# EAGLE design Nutrient Management Control v2.2 (EAGLE 9.6.2)
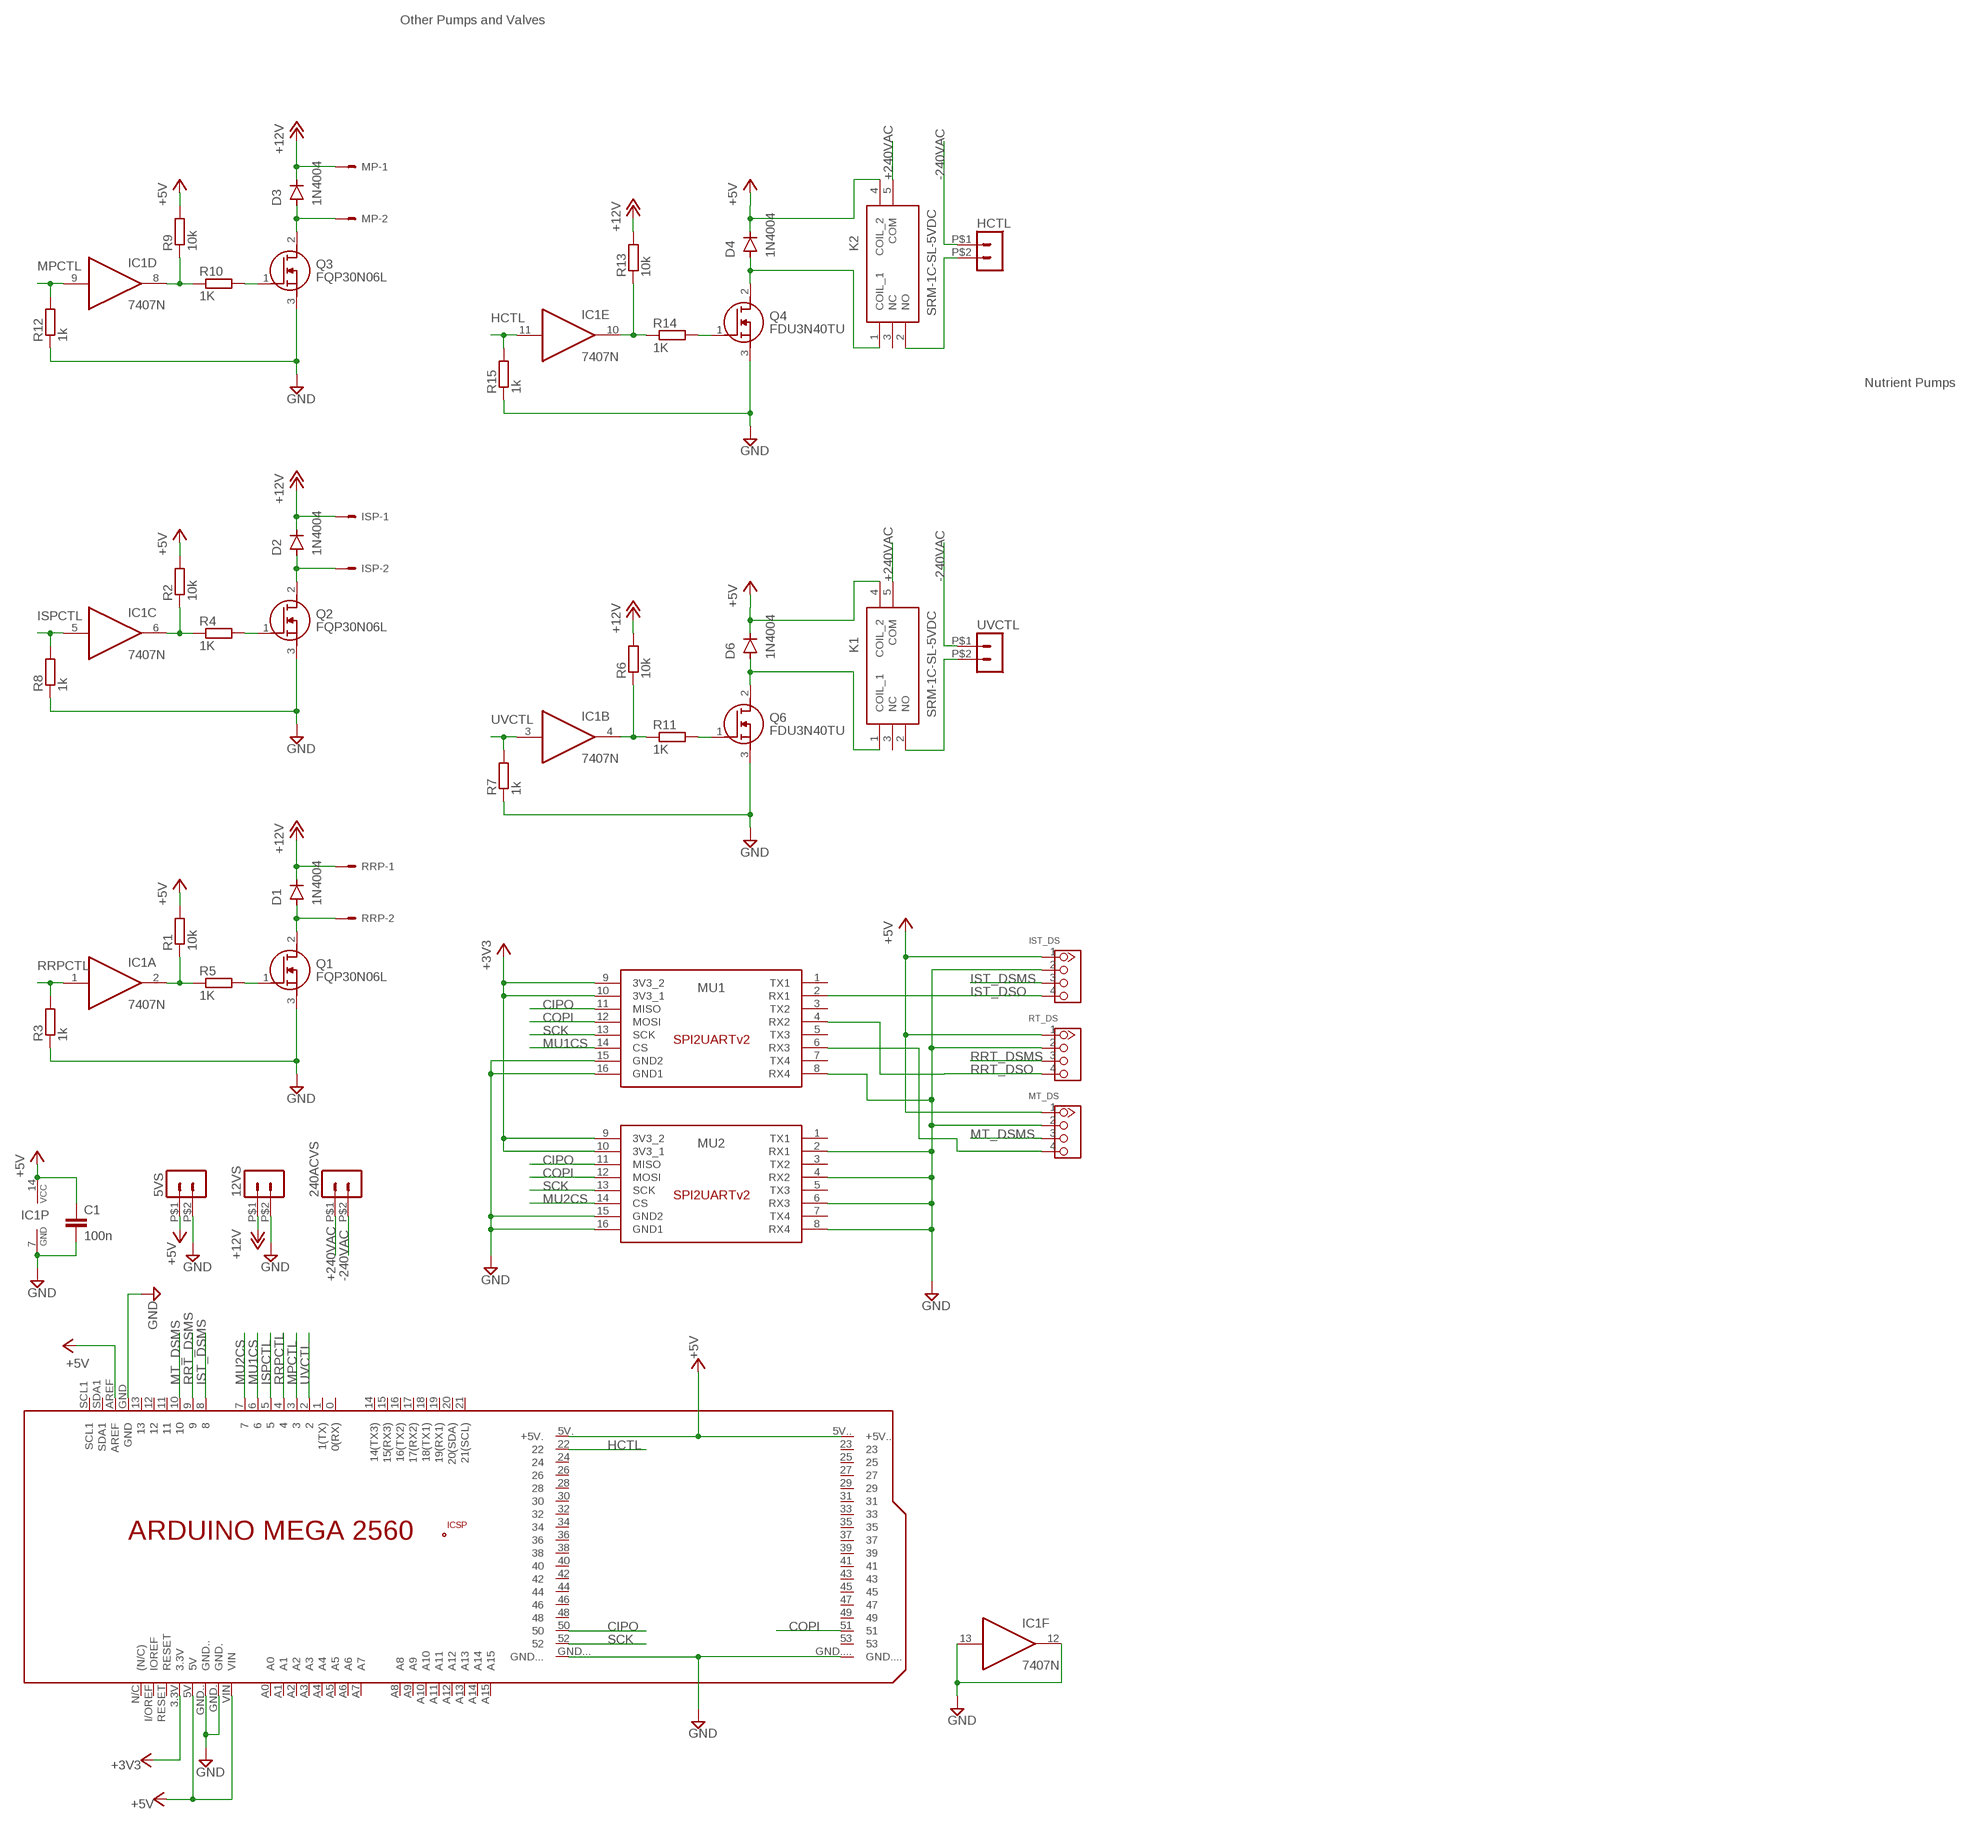
[diagram p0: schematic, sheet 1]

## Parts
5VS  HEADER_POS2_43650-0215  [43650-0215]
12VS  HEADER_POS2_43650-0215  [43650-0215]
240ACVS  HEADER_POS2_43650-0215  [43650-0215]
C1  100n  C-EU050-024X044  [C050-024X044]
D1  1N4004  [DO-41]
D2  1N4004  [DO-41]
D3  1N4004  [DO-41]
D4  1N4004  [DO-41]
D6  1N4004  [DO-41]
HCTL  HEADER_POS2_43650-0215  [43650-0215]
IC1  7407N  [DIL14]
ISP  JST-XH-02-PIN-LONG-PAD  [JST-XH-02-PACKAGE-LONG-PAD]
IST_DS  4P-2.0-90D  GROVE-CONNECTOR-DIP-90D(4P-2.0)  [HW4-2.0-90D]
K1  SRM-1C-SL-5VDC  [SRM1CSL5VDC]
K2  SRM-1C-SL-5VDC  [SRM1CSL5VDC]
MP  JST-XH-02-PIN-LONG-PAD  [JST-XH-02-PACKAGE-LONG-PAD]
MT_DS  4P-2.0-90D  GROVE-CONNECTOR-DIP-90D(4P-2.0)  [HW4-2.0-90D]
MU1  SPI2UART_HEADERS  [SPI2UARTV2]
MU2  SPI2UART_HEADERS  [SPI2UARTV2]
PCB2  ARDUINO_MEGA2560_SHIELD  [ARDUINO_MEGA2560_SHIELD]
Q1  FQP30N06L  [TO254P470X1016X2019-3P]
Q2  FQP30N06L  [TO254P470X1016X2019-3P]
Q3  FQP30N06L  [TO254P470X1016X2019-3P]
Q4  FDU3N40TU  [TO229P250X658X985-3P]
Q6  FDU3N40TU  [TO229P250X658X985-3P]
R1  10k  R-EU_0204/7  [0204/7]
R2  10k  R-EU_0204/7  [0204/7]
R3  1k  R-EU_0204/7  [0204/7]
R4  1K  R-EU_0204/7  [0204/7]
R5  1K  R-EU_0204/7  [0204/7]
R6  10k  R-EU_0204/7  [0204/7]
R7  1k  R-EU_0204/7  [0204/7]
R8  1k  R-EU_0204/7  [0204/7]
R9  10k  R-EU_0204/7  [0204/7]
R10  1K  R-EU_0204/7  [0204/7]
R11  1K  R-EU_0204/7  [0204/7]
R12  1k  R-EU_0204/7  [0204/7]
R13  10k  R-EU_0204/7  [0204/7]
R14  1K  R-EU_0204/7  [0204/7]
R15  1k  R-EU_0204/7  [0204/7]
RRP  JST-XH-02-PIN-LONG-PAD  [JST-XH-02-PACKAGE-LONG-PAD]
RT_DS  4P-2.0-90D  GROVE-CONNECTOR-DIP-90D(4P-2.0)  [HW4-2.0-90D]
UVCTL  HEADER_POS2_43650-0215  [43650-0215]

## Nets
+3V3: MU1.9(3V3_2) MU1.10(3V3_1) MU2.9(3V3_2) MU2.10(3V3_1) PCB2.3.3V
+5V [5V]: 5VS.P$1 C1.1 D4.C D6.C IC1.14(P:VCC) IST_DS.1 K1.4(COIL_2) K2.4(COIL_2) MT_DS.1 PCB2.5V PCB2.5V.(+5V.) PCB2.5V..(+5V..) PCB2.AREF PCB2.VIN R1.2 R2.2 R9.2 RT_DS.1
+12V [12V]: 12VS.P$1 D1.C D2.C D3.C ISP.1 MP.1 R6.2 R13.2 RRP.1
+240VAC [240VAC]: 240ACVS.P$1 K1.5(COM) K2.5(COM)
-240VAC [240VAC]: 240ACVS.P$2 HCTL.P$1 UVCTL.P$1
CIPO: MU1.11(MISO) MU2.11(MISO) PCB2.50
COPI: MU1.12(MOSI) MU2.12(MOSI) PCB2.51
GND: 5VS.P$2 12VS.P$2 C1.2 IC1.7(P:GND) IC1.12(F:O) IC1.13(F:I) IST_DS.2 MT_DS.2 MU1.8(RX4) MU1.15(GND2) MU1.16(GND1) MU2.2(RX1) MU2.4(RX2) MU2.6(RX3) MU2.8(RX4) MU2.15(GND2) MU2.16(GND1) PCB2.GND PCB2.GND. PCB2.GND.. PCB2.GND... PCB2.GND.... Q1.3(S) Q2.3(S) Q3.3(S) Q4.3(S) Q6.3(S) R3.1 R7.1 R8.1 R12.1 R15.1 RT_DS.2
HCTL: IC1.11(E:I) PCB2.22 R15.2
ISPCTL: IC1.5(C:I) PCB2.5 R8.2
IST_DSMS: IST_DS.3 PCB2.8
IST_DSO: IST_DS.4 MU1.2(RX1)
MPCTL: IC1.9(D:I) PCB2.3 R12.2
MT_DSMS: MT_DS.3 PCB2.10
MU1CS: MU1.14(CS) PCB2.6
MU2CS: MU2.14(CS) PCB2.7
N$1 [Pumps]: D2.A ISP.2 Q2.2(D)
N$2: IC1.6(C:O) R2.1 R4.1
N$3: IC1.2(A:O) R1.1 R5.1
N$4: Q2.1(G) R4.2
N$5: Q1.1(G) R5.2
N$6 [Pumps]: D3.A MP.2 Q3.2(D)
N$7 [240VAC]: K1.2(NO) UVCTL.P$2
N$8: IC1.8(D:O) R9.1 R10.1
N$9: Q3.1(G) R10.2
N$10 [Pumps]: D1.A Q1.2(D) RRP.2
N$11: MT_DS.4 MU1.6(RX3)
N$12: D4.A K2.1(COIL_1) Q4.2(D)
N$13: Q6.1(G) R11.2
N$14 [240VAC]: HCTL.P$2 K2.2(NO)
N$15: Q4.1(G) R14.2
N$16: IC1.10(E:O) R13.1 R14.1
N$17: IC1.4(B:O) R6.1 R11.1
N$21: D6.A K1.1(COIL_1) Q6.2(D)
RRPCTL: IC1.1(A:I) PCB2.4 R3.2
RRT_DSMS: PCB2.9 RT_DS.3
RRT_DSO: MU1.4(RX2) RT_DS.4
SCK: MU1.13(SCK) MU2.13(SCK) PCB2.52
UVCTL: IC1.3(B:I) PCB2.2 R7.2
Unconnected: K1.3(NC) K2.3(NC) MU1.1(TX1) MU1.3(TX2) MU1.5(TX3) MU1.7(TX4) MU2.1(TX1) MU2.3(TX2) MU2.5(TX3) MU2.7(TX4) PCB2.0(0(RX)) PCB2.1(1(TX)) PCB2.11 PCB2.12 PCB2.13 PCB2.14(14(TX3)) PCB2.15(15(RX3)) PCB2.16(16(TX2)) PCB2.17(17(RX2)) PCB2.18(18(TX1)) PCB2.19(19(RX1)) PCB2.20(20(SDA)) PCB2.21(21(SCL)) PCB2.23 PCB2.24 PCB2.25 PCB2.26 PCB2.27 PCB2.28 PCB2.29 PCB2.30 PCB2.31 PCB2.32 PCB2.33 PCB2.34 PCB2.35 PCB2.36 PCB2.37 PCB2.38 PCB2.39 PCB2.40 PCB2.41 PCB2.42 PCB2.43 PCB2.44 PCB2.45 PCB2.46 PCB2.47 PCB2.48 PCB2.49 PCB2.53 PCB2.+5V_ PCB2.A0 PCB2.A1 PCB2.A2 PCB2.A3 PCB2.A4 PCB2.A5 PCB2.A6 PCB2.A7 PCB2.A8 PCB2.A9 PCB2.A10 PCB2.A11 PCB2.A12 PCB2.A13 PCB2.A14 PCB2.A15 PCB2.GND__ PCB2.I/OREF(IOREF) PCB2.MISO PCB2.MOSI PCB2.N/C((N/C)) PCB2.RESET PCB2.RESET. PCB2.SCK PCB2.SCL1 PCB2.SDA1

## Notes on the sheet
- Other Pumps and Valves
- Nutrient Pumps

## Library data of the parts
5VS 12VS 240ACVS HCTL UVCTL = Aeroponics Control:HEADER_POS2_?: Molex - Micro-Fit 3.0 Series connector, 3.00mm (0.118") pitch header, 2 positions.
C1 = Aeroponics Control:C-EU: CAPACITOR, European symbol
D1-D4 D6 = Aeroponics Control:1N4004: DIODE GEN PURP 400V 1A DO41 Manufacturer's datasheet <https://www.mccsemi.com/pdf/Products/1N4001-1N4007(DO-41).pdf>; CREATED_BY: PCBLayout.com; DIGIKEY_PART_NUMBER: 1N4004MSCT-ND; MANUFACTURER: Micro Commercial Co; MPN: 1N4004; PACKAGE: DO-41
IC1 = Aeroponics Control:74*07: Hex BUFFER, open collector high-voltage output
ISP MP RRP = Aeroponics Control:JST-XH-02-PIN: JST XH Connector 2 Pin Wire to board connector. Pitch: 2,54 mm, (0.100") Number of pins: 2 Created by Rembrandt Electronics www.rembrandtelectronics.com
IST_DS MT_DS RT_DS = Aeroponics Control:GROVE-CONNECTOR-DIP-90D(4P-2.0): 320110034
K1 K2 = Aeroponics Control:SRM-1C-SL-5VDC: IMO PRECISION CONTROLS - SRM-1C-SL-5VDC - RELAY, SPDT, 277VAC, 250VDC, 10A Source: Datasheet <https://componentsearchengine.com/Datasheets/2/SRM-1C-SL-5VDC.pdf>; DESCRIPTION: IMO PRECISION CONTROLS - SRM-1C-SL-5VDC - RELAY, SPDT, 277VAC, 250VDC, 10A; HEIGHT: 15.5mm; MANUFACTURER_NAME: IMO PRECISION CONTROLS; MANUFACTURER_PART_NUMBER: SRM-1C-SL-5VDC
MU1 MU2 = Aeroponics Control:SPI2UART_HEADERS
PCB2 = Aeroponics Control:ARDUINO_MEGA2560_SHIELD: Device for representing an Arduino Mega 2560 board with a footprint in an EAGLE design. Created by Dave Young for Element14. More EAGLE documentation at: http://www.element14.com/community/community/knode/cadsoft_eagle
Q1-Q3 = Aeroponics Control:FQP30N06L: FQP30N06L N-Channel MOSFET, 32 A, 60 V QFET, 3-Pin TO-220 ON Semiconductor Source: Datasheet <http://uk.rs-online.com/web/p/products/8075863P>; DESCRIPTION: FQP30N06L N-Channel MOSFET, 32 A, 60 V QFET, 3-Pin TO-220 ON Semiconductor; HEIGHT: 4.7mm; MANUFACTURER_NAME: onsemi; MANUFACTURER_PART_NUMBER: FQP30N06L; RS_PART_NUMBER: 8075863P; RS_PRICE-STOCK: http://uk.rs-online.com/web/p/products/8075863P
Q4 Q6 = Aeroponics Control:FDU3N40TU: Fairchild FDU3N40TU N-channel MOSFET Transistor, 2 A, 400 V, 3-Pin IPAK Source: Datasheet <http://uk.rs-online.com/web/p/products/8070701P>; DESCRIPTION: Fairchild FDU3N40TU N-channel MOSFET Transistor, 2 A, 400 V, 3-Pin IPAK; HEIGHT: 2.5mm; MANUFACTURER_NAME: onsemi; MANUFACTURER_PART_NUMBER: FDU3N40TU; RS_PART_NUMBER: 8070701P; RS_PRICE-STOCK: http://uk.rs-online.com/web/p/products/8070701P
R1-R15 = Aeroponics Control:R-EU_: RESISTOR, European symbol

## Net classes
1 240VAC: width 0.254 mm, drill 0.254 mm, clearance 0.508 mm
2 24VAC: width 0.762 mm, drill 0.762 mm, clearance 0.508 mm
3 5V: width 0.508 mm, drill 0.508 mm, clearance 0.254 mm
4 12V: width 2.032 mm, drill 2.032 mm, clearance 0.254 mm
5 Pumps: width 0.762 mm, drill 0.762 mm, clearance 0.254 mm
6 Solenoids: width 0.254 mm, drill 0.254 mm, clearance 0.254 mm

## Board
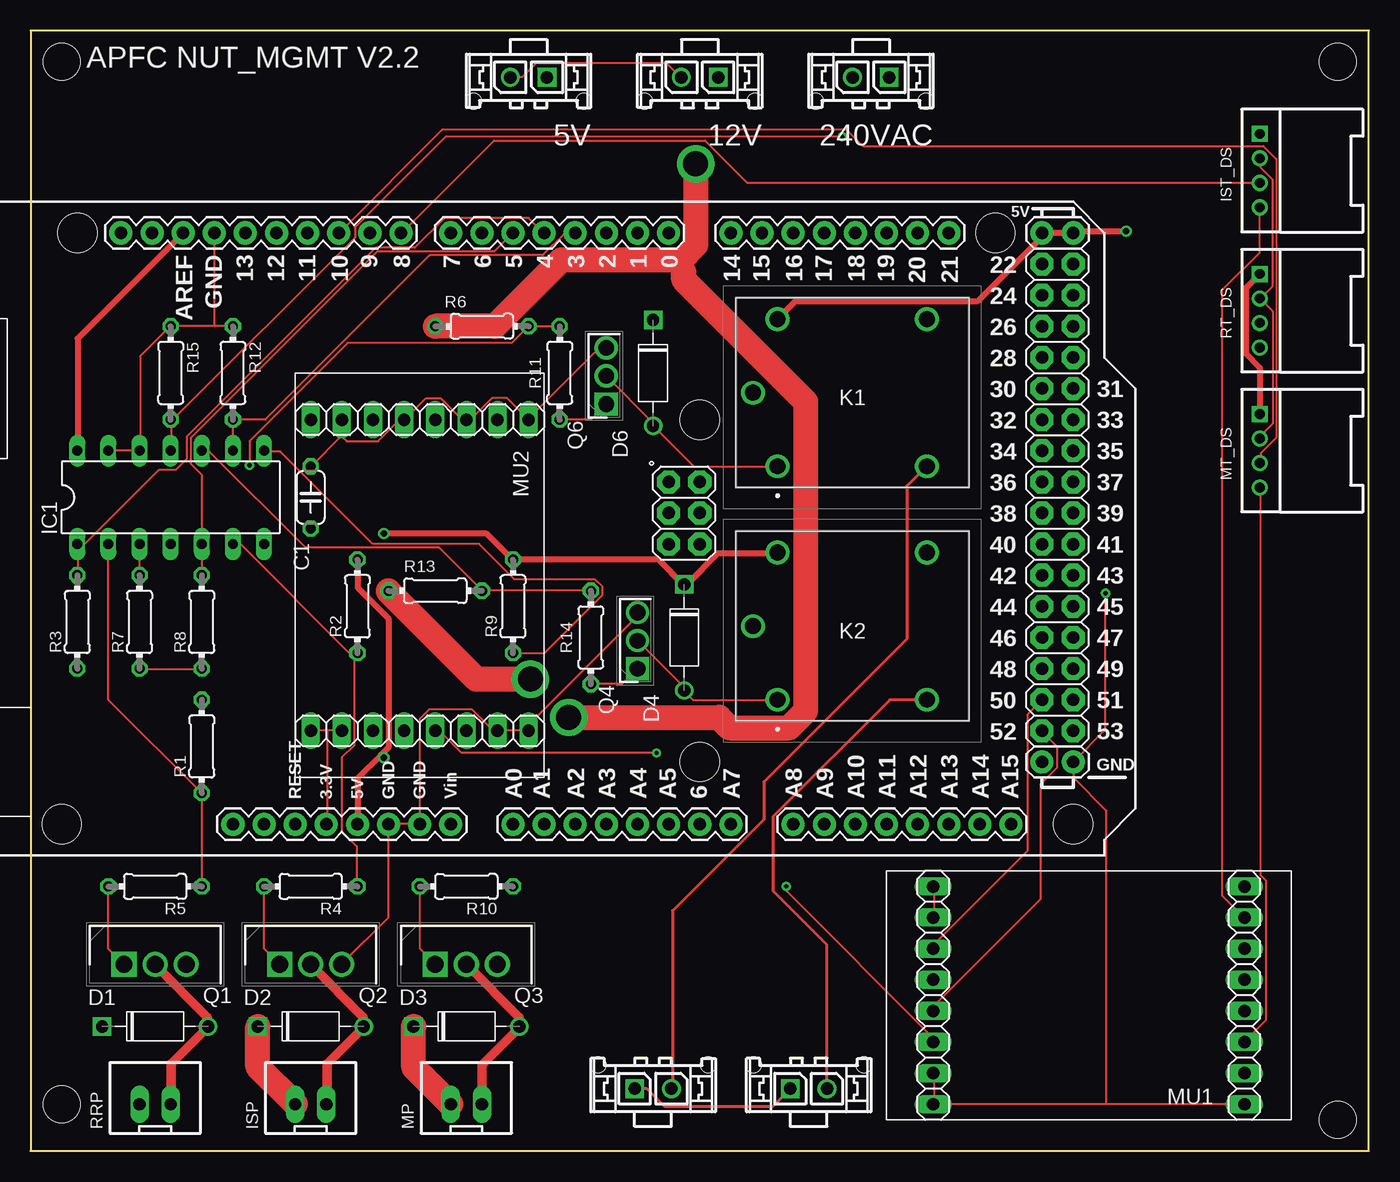
[diagram p1: board, top side]
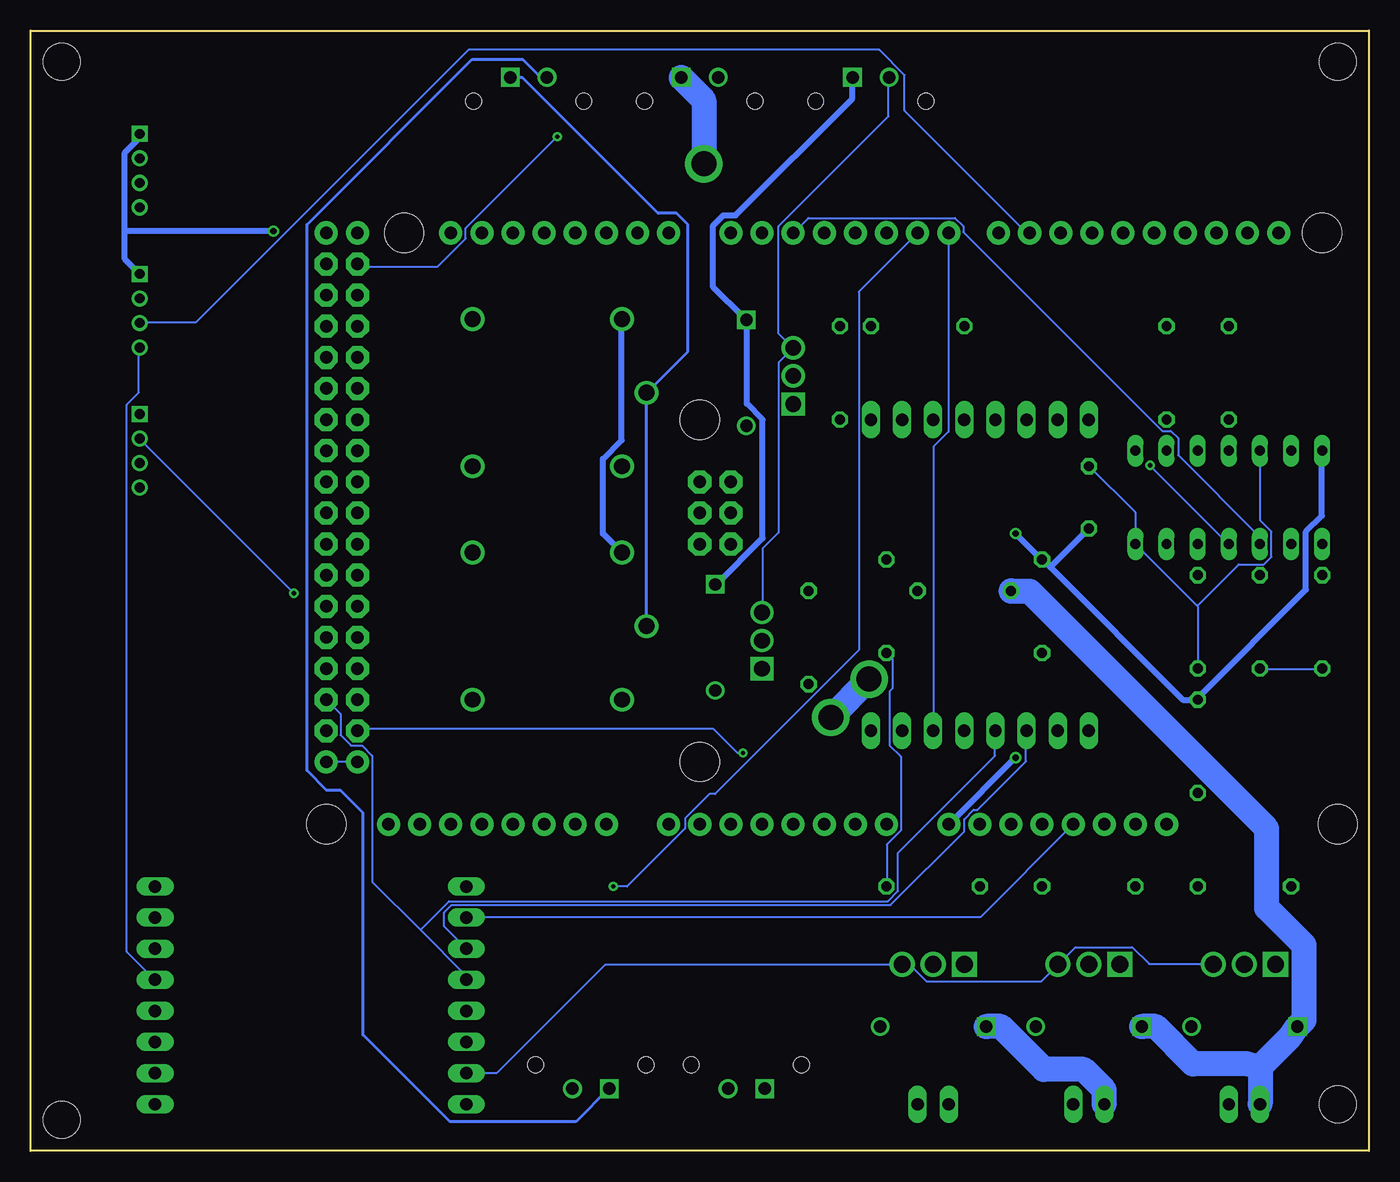
[diagram p2: board, bottom side, seen from below]

Size 109.22 x 91.44 mm. Coordinates in mm from the lower left corner, seen from the top.
Outline: 0,0 109.22,0 109.22,91.44 0,91.44 0,0
Copper layers (1*16): Top 0.035mm / dielectric 1.5mm / Bottom 0.035mm
Design rules "default": minimum track width 6mil, minimum drill 0.35mm, track to track 6mil, track to pad 6mil, pad to pad 6mil, via to via 6mil, smd to smd 6mil, copper to edge 40mil, drill to drill 6mil, minimum pad ring 10mil, minimum via ring 8mil, stop-mask expansion 4mil, vias tented up to drill 0mil, thermal gap 10mil
Holes 3 mm at 2.54,88.9 106.68,88.9 106.68,2.54 2.54,3.81

### Footprints (pad centres in the part's own frame; a part is rotated, then mirrored left to right if it is on the bottom)
43650-0215 = drill 1.02 square: P$1 1.5,0 | drill 1.02: P$2 -1.5,0 | hole 1.27: 4.5,-1.96; -4.5,-1.96
C050-024X044 = drill 0.813 octagon: 1 -2.54,0; 2 2.54,0
DO-41 = drill 1: A 4.325,0 | drill 1 square: C -4.325,0
DIL14 = drill 0.813 long: 1 -7.62,-3.81; 2 -5.08,-3.81; 3 -2.54,-3.81; 4 0,-3.81; 5 2.54,-3.81; 6 5.08,-3.81; 7 7.62,-3.81; 8 7.62,3.81; 9 5.08,3.81; 10 2.54,3.81; 11 0,3.81; 12 -2.54,3.81; 13 -5.08,3.81; 14 -7.62,3.81
JST-XH-02-PACKAGE-LONG-PAD = drill 1.016 long: 1 -1.27,0; 2 1.27,0
HW4-2.0-90D = drill 0.8 pad 1.27 square: 1 -3,0 | drill 0.8 pad 1.27: 2 -1,0; 3 1,0; 4 3,0
SRM1CSL5VDC = drill 1.3 pad 1.95: 1 0,0; 2 12.2,0; 3 12.2,12; 4 0,12; 5 -2,6
SPI2UARTV2 = drill 1.016 long: 1 -12.7,-8.89; 2 -12.7,-6.35; 3 -12.7,-3.81; 4 -12.7,-1.27; 5 -12.7,1.27; 6 -12.7,3.81; 7 -12.7,6.35; 8 -12.7,8.89; 9 12.7,-8.89; 10 12.7,-6.35; 11 12.7,-3.81; 12 12.7,-1.27; 13 12.7,1.27; 14 12.7,3.81; 15 12.7,6.35; 16 12.7,8.89
ARDUINO_MEGA2560_SHIELD = drill 1.016 pad 1.88: 0 63.5,50.8; 1 60.96,50.8; 2 58.42,50.8; 3 55.88,50.8; 3.3V 35.56,2.54; 4 53.34,50.8; 5 50.8,50.8; 5V 38.1,2.54; 5V. 93.98,50.8; 5V.. 96.52,50.8; 6 48.26,50.8; 7 45.72,50.8; 8 41.656,50.8; 9 39.116,50.8; 10 36.576,50.8; 11 34.036,50.8; 12 31.496,50.8; 13 28.956,50.8; 14 68.58,50.8; 15 71.12,50.8; 16 73.66,50.8; 17 76.2,50.8; 18 78.74,50.8; 19 81.28,50.8; 20 83.82,50.8; 21 86.36,50.8; A0 50.8,2.54; A1 53.34,2.54; A2 55.88,2.54; A3 58.42,2.54; A4 60.96,2.54; A5 63.5,2.54; A6 66.04,2.54; A7 68.58,2.54; A8 73.66,2.54; A9 76.2,2.54; A10 78.74,2.54; A11 81.28,2.54; A12 83.82,2.54; A13 86.36,2.54; A14 88.9,2.54; A15 91.44,2.54; AREF 23.876,50.8; GND 26.416,50.8; GND. 43.18,2.54; GND.. 40.64,2.54; GND... 93.98,7.62; GND.... 96.52,7.62; I/OREF 30.48,2.54; N/C 27.94,2.54; RESET 33.02,2.54; SCL1 18.796,50.8; SDA1 21.336,50.8; VIN 45.72,2.54 | drill 1.016 pad 1.88 octagon: 22 93.98,48.26; 23 96.52,48.26; 24 93.98,45.72; 25 96.52,45.72; 26 93.98,43.18; 27 96.52,43.18; 28 93.98,40.64; 29 96.52,40.64; 30 93.98,38.1; 31 96.52,38.1; 32 93.98,35.56; 33 96.52,35.56; 34 93.98,33.02; 35 96.52,33.02; 36 93.98,30.48; 37 96.52,30.48; 38 93.98,27.94; 39 96.52,27.94; 40 93.98,25.4; 41 96.52,25.4; 42 93.98,22.86; 43 96.52,22.86; 44 93.98,20.32; 45 96.52,20.32; 46 93.98,17.78; 47 96.52,17.78; 48 93.98,15.24; 49 96.52,15.24; 50 93.98,12.7; 51 96.52,12.7; 52 93.98,10.16; 53 96.52,10.16; +5V_ 66.04,30.48; GND__ 66.04,25.4; MISO 63.5,30.48; MOSI 66.04,27.94; RESET. 63.5,25.4; SCK 63.5,27.94 | hole 3.2: 15.24,50.8; 13.97,2.54; 66.04,35.56; 66.04,7.62; 90.17,50.8; 96.52,2.54
TO254P470X1016X2019-3P = drill 1.37 pad 2.055 square: 1 0,0 | drill 1.37 pad 2.055: 2 2.535,0; 3 5.07,0
TO229P250X658X985-3P = drill 1.27 pad 1.905 square: 1 0,0 | drill 1.27 pad 1.905: 2 2.29,0; 3 4.58,0
0204/7 = drill 0.813 octagon: 1 -3.81,0; 2 3.81,0

### Placement (x,y rotation side)
5VS  40.64,87.63 0 top
12VS  54.61,87.63 0 top
240ACVS  68.58,87.63 0 top
C1  22.86,53.34 90 top
D1  10.16,10.16 0 top
D2  22.86,10.16 0 top
D3  35.56,10.16 0 top
D4  53.34,41.91 270 top
D6  50.8,63.5 270 top
HCTL  63.5,5.08 180 top
IC1  11.43,53.34 0 top
ISP  22.86,3.81 0 top
IST_DS  100.33,80.01 270 top
K1  60.96,55.88 0 top
K2  60.96,36.83 0 top
MP  35.56,3.81 0 top
MT_DS  100.33,57.15 270 top
MU1  86.36,12.7 180 top
MU2  31.75,46.99 270 top
PCB2  -11.43,24.13 0 top
Q1  7.62,15.24 0 top
Q2  20.32,15.24 0 top
Q3  33.02,15.24 0 top
Q4  49.53,39.37 90 top
Q6  46.99,60.96 90 top
R1  13.97,33.02 90 top
R2  26.67,44.45 90 top
R3  3.81,43.18 90 top
R4  22.86,21.59 180 top
R5  10.16,21.59 180 top
R6  36.83,67.31 180 top
R7  8.89,43.18 90 top
R8  13.97,43.18 90 top
R9  39.37,44.45 90 top
R10  35.56,21.59 180 top
R11  43.18,63.5 270 top
R12  16.51,63.5 270 top
R13  33.02,45.72 180 top
R14  45.72,41.91 270 top
R15  11.43,63.5 270 top
RRP  10.16,3.81 0 top
RT_DS  100.33,68.58 270 top
UVCTL  50.8,5.08 180 top

### Tracks (layer width: path | path; a pad name or v marks a point on that pad's centre or on a via)
+3V3
  Top 0.152: MU1.10 73.71,19.07 73.71,21.59 MU1.9 | 24.18,34.31 25.4,34.31 MU2.10 | 24.18,34.31 22.89,34.31 MU2.9 | 24.18,34.31 24.18,26.7 PCB2.3.3V
  Bottom 0.152: MU1.10 73.64,19.07 31.72,19.07 24.18,26.62 PCB2.3.3V
+5V  (via drill 0.51)
  Top 0.508: PCB2.AREF 3.84,66.32 3.84,57.17 IC1.14 | 28.6,32.33 29.21,32.94 29.21,43.46 26.7,45.97 26.7,48.26 R2.2 | 28.6,32.33 26.7,30.43 26.7,26.7 PCB2.5V | v28.83,32.11 28.75,32.18 28.6,32.33 | MT_DS.1 100.31,60.22 100.31,63.96 99.16,65.1 99.16,70.43 100.31,71.58 RT_DS.1 | K2.4 60.91,48.79 56.11,48.79 53.59,46.28 D4.C 53.29,46.2 51.23,48.26 39.42,48.26 R9.2 39.19,48.41 37.21,50.39 v28.83,50.39 | K1.4 60.98,67.92 62.43,69.37 77.29,69.37 82.47,74.55 82.47,74.7 PCB2.5V. 85.06,74.93 PCB2.5V.. 85.29,75.08 v89.41,75.08
  Bottom 0.508: 26.01,47.65 26.62,48.26 R2.2 26.85,48.41 v28.83,50.39 | 26.01,47.65 15.19,36.83 R1.2 13.89,37.06 5.13,45.82 5.13,50.55 3.84,51.84 3.84,57.1 IC1.14 | C1.1 22.89,50.78 25.86,47.8 26.01,47.65 | v28.83,32.11 34.24,26.7 PCB2.VIN | 101.52,75.08 101.52,72.8 100.38,71.65 RT_DS.1 | 101.52,75.08 101.52,81.48 100.38,82.63 100.38,83.01 IST_DS.1 | D4.C 53.29,46.2 49.48,50.01 49.48,59.69 50.77,60.98 50.77,67.77 D6.C 51,68 53.52,70.51 53.52,75.54 52.68,76.38 51.69,76.38 42.16,85.9 42.16,87.58 5VS.P$1 | K1.4 60.98,67.84 60.98,58.01 62.51,56.49 62.51,50.39 60.98,48.87 K2.4 | v89.41,75.08 101.3,75.08 101.52,75.08
+12V  (via drill 2.03)
  Top 2.032: R6.2 37.9,67.31 43.31,72.72 53.06,72.72 | 53.06,72.72 54.28,73.94 v54.28,80.57 | D3.C 31.27,10.16 31.27,6.81 34.24,3.83 MP.1 | D2.C 18.54,10.16 18.54,6.88 21.59,3.83 ISP.1 | v43.92,35.38 56.18,35.38 57.02,34.54 61.9,34.54 63.27,35.92 63.27,61.14 53.29,71.12 53.29,71.73 53.06,72.72 | v40.79,38.51 36.37,38.51 29.21,45.67 R13.2
  Bottom 2.032: v54.28,80.57 54.28,85.75 56.11,87.58 12VS.P$1 | R13.2 29.21,45.67 27.69,45.67 8.33,26.31 8.33,19.84 5.28,16.79 5.28,10.69 5.82,10.16 D1.C 6.43,9.32 8.87,6.88 | 8.87,6.88 8.87,3.83 RRP.1 | D2.C 18.47,10.16 17.4,10.16 14.35,7.11 9.86,7.11 8.87,6.88 | D3.C 31.19,10.16 30.05,10.16 26.54,6.66 23.27,6.66 21.59,4.98 21.59,3.83 ISP.1 | v40.79,38.51 v43.92,35.38
+240VAC
  Bottom 0.254: 240ACVS.P$1 70.05,87.58 69.06,87.58 58.01,76.53 56.49,76.53 55.57,75.62 55.57,65.25 58.93,61.9 K1.5 59,61.82 59,42.85 K2.5
-240VAC
  Top 0.254: UVCTL.P$1 49.33,5.05 50.32,5.05 51.76,3.61 60.53,3.61 61.98,5.05 HCTL.P$1
  Bottom 0.254: 240ACVS.P$2 67.08,87.66 67.62,87.66 69.06,89.1 73.18,89.1 86.67,75.62 86.67,31.04 85.06,29.44 83.92,29.44 82.09,27.61 82.09,9.47 75.01,2.39 64.72,2.39 62.05,5.05 HCTL.P$1
CIPO
  Top 0.152: PCB2.50 81.33,35.61 81.33,24.49 73.71,16.87 73.71,16.56 MU1.11
  Bottom 0.152: MU2.11 27.99,34.24 27.99,31.8 31.95,27.84 32.26,27.84 33.02,27.08 33.02,26.09 39.04,20.07 74.85,20.07 75.46,19.46 75.46,18.31 73.71,16.56 MU1.11
COPI
  Bottom 0.152: 77.41,18.05 81.33,21.97 81.33,32.26 82.17,33.1 83.08,33.1 83.92,33.93 83.92,35.69 85.06,36.83 PCB2.51 | 77.41,18.05 73.71,14.35 73.71,13.97 MU1.12 | MU2.12 30.5,34.24 30.5,32.26 38.43,24.33 38.43,21.21 39.27,20.37 75.08,20.37 77.37,18.09 77.41,18.05
GND  (via drill 0.35)
  Top 0.152: MT_DS.2 100.38,58.17 100.38,58.39 101.37,59.39 101.37,68.53 100.38,69.52 RT_DS.2 100.38,69.6 101.37,70.59 101.37,79.27 100.38,80.26 100.38,80.95 IST_DS.2 | MU1.15 73.71,6.35 73.71,3.83 MU1.16 73.79,3.83 87.81,3.83 | 87.81,3.83 99.01,3.83 MU1.8 | 87.81,3.83 87.81,27.76 85.14,30.43 85.14,31.73 PCB2.GND.... 85.14,31.8 87.73,34.39 v87.73,45.52 | 40.64,34.31 38.12,34.31 MU2.15 38.05,34.31 37.74,34.31 35.99,36.07 32.56,36.07 31.8,35.31 31.8,26.7 PCB2.GND. 31.72,26.7 29.21,26.7 PCB2.GND.. 29.21,26.62 29.21,19.07 25.4,15.27 Q2.3 | 40.64,34.31 MU2.16 40.64,34.31 | 40.64,34.31 40.64,34.77 49.48,43.61 49.48,43.92 Q4.3 | 5VS.P$2 39.19,87.66 40.11,87.66 41.25,88.8 51.92,88.8 53.06,87.66 12VS.P$2 | Q6.3 46.96,65.48 46.35,65.48 40.64,59.77 MU2.8 38.89,61.44 37.67,61.44 35.92,59.69 35.61,59.69 MU2.6 35.53,59.69 35.23,59.69 33.48,61.44 32.26,61.44 30.5,59.69 MU2.4 30.43,59.69 30.12,59.69 28.37,57.94 25.78,57.94 25.4,58.32 MU2.2 25.4,58.39 22.89,55.88 C1.2 | IC1.13 6.35,57.17 8.87,57.17 IC1.12 8.94,57.17 8.94,64.87 11.38,67.31 R15.1 11.46,67.31 15.04,67.31 | 15.04,67.31 16.48,67.31 R12.1 | 15.04,67.31 15.04,74.93 PCB2.GND | R8.1 13.97,39.34 8.94,39.34 R7.1
  Bottom 0.152: PCB2.GND... 82.55,31.8 85.06,31.8 PCB2.GND.... | v87.73,45.52 100.31,58.09 MT_DS.2 | Q1.3 12.75,15.27 17.93,15.27 19.3,16.64 23.95,16.64 25.32,15.27 Q2.3 25.4,15.19 26.77,13.82 36.07,13.82 37.44,15.19 38.05,15.19 Q3.3 38.12,15.19 62.36,15.19 71.2,6.35 73.64,6.35 MU1.15 | 5VS.P$2 39.19,87.58 39.19,84.45 48.18,75.46 48.18,66.7 47.04,65.56 Q6.3 47.04,65.48 48.18,64.34 48.18,50.47 49.48,49.17 49.48,43.99 Q4.3 | R3.1 3.84,39.34 8.87,39.34 R7.1 | C1.2 22.81,55.88 19.07,52.15 19.07,49.56 IC1.7 19,49.48 14.01,44.49 | 14.01,44.49 13.97,44.45 13.97,39.42 R8.1 | IC1.12 8.87,57.1 8.87,51.46 7.95,50.55 7.95,48.49 8.56,47.88 10.62,47.88 13.97,44.53 14.01,44.49
HCTL  (via drill 0.35)
  Top 0.152: 11.46,59.69 11.46,57.17 IC1.11 | 11.46,59.69 R15.2 11.46,59.69 | 11.46,59.69 11.61,59.69 26.47,74.55 26.47,75.39 33.86,82.78 v66.24,82.78
  Bottom 0.152: v66.24,82.78 73.71,75.31 73.71,74.47 76,72.19 82.4,72.19 82.55,72.34 PCB2.22
ISPCTL
  Top 0.152: R8.2 13.97,47.04 13.97,49.48 IC1.5 13.97,49.56 13.97,55.19 13.06,56.11 13.06,58.17 28.3,73.41 37.82,73.41 39.34,74.93 PCB2.5
IST_DSMS
  Top 0.152: IST_DS.3 100.31,79.05 58.47,79.05 55.04,82.47 37.82,82.47 30.28,74.93 PCB2.8
IST_DSO
  Top 0.152: IST_DS.4 100.31,76.99 100.31,73.33 97.26,70.28 97.26,20.83 99.01,19.07 MU1.2
MPCTL
  Top 0.152: IC1.9 16.48,57.17 16.48,59.69 R12.2 16.56,59.69 19.15,59.69 32.56,73.1 41.78,73.1 43.61,74.93 PCB2.3
MT_DSMS
  Top 0.152: MT_DS.3 100.38,56.19 100.38,56.95 101.68,58.24 101.68,80.95 100.61,82.02 67.92,82.02 66.55,83.39 33.63,83.39 25.17,74.93 PCB2.10
MU1CS  (via drill 0.35)
  Top 0.152: v61.67,21.59 61.67,21.21 73.64,9.25 73.64,8.94 MU1.14
  Bottom 0.152: v61.67,21.59 60.53,21.59 55.8,26.31 55.8,27.15 53.82,29.13 53.36,29.13 41.63,40.87 41.63,70.13 PCB2.6
MU2CS
  Bottom 0.152: MU2.14 35.53,34.31 35.53,57.48 34.31,58.7 34.31,74.93 PCB2.7
N$1
  Top 0.762: Q2.2 22.89,15.19 27.15,10.92 27.15,10.16 D2.A 26.92,9.86 24.18,7.11 24.18,3.83 ISP.2
N$2
  Top 0.152: 26.39,40.64 26.62,40.64 R2.1 26.39,40.64 | 26.39,40.64 26.01,40.64 17.17,49.48 16.56,49.48 IC1.6 | 26.39,40.64 26.39,33.1 25.4,32.11 25.4,26.09 26.62,24.87 26.62,21.59 R4.1
N$3
  Top 0.152: R5.1 R1.1 6.35,36.83 6.35,49.48 IC1.2
N$4
  Top 0.152: R4.2 19.07,21.59 19.07,16.48 20.3,15.27 Q2.1
N$5
  Top 0.152: R5.2 6.35,16.48 7.57,15.27 Q1.1
N$6
  Top 0.762: Q3.2 35.61,15.19 39.88,10.92 39.88,10.16 D3.A 39.65,9.86 36.83,7.04 36.83,3.83 MP.2
N$7
  Top 0.254: UVCTL.P$2 52.38,5.13 52.38,19.61 59.84,27.08 59.84,30.12 71.5,41.78 71.5,54.28 73.1,55.88 K1.2
N$8
  Top 0.152: IC1.8 19.07,57.1 20.37,57.1 27.91,49.56 36.6,49.56 39.5,46.66 46.05,46.66 46.66,46.05 46.66,45.36 41.93,40.64 39.42,40.64 R9.1
  Bottom 0.152: R10.1 39.34,21.59 39.34,25.02 38.2,26.16 38.2,32.18 39.12,33.1 39.12,37.52 38.89,37.74 38.89,40.18 39.34,40.64 R9.1
N$9
  Top 0.152: R10.2 31.8,21.59 31.8,16.48 33.02,15.27 Q3.1
N$10
  Top 0.762: Q1.2 10.16,15.19 14.43,10.92 14.43,10.16 D1.A 14.2,9.86 11.46,7.11 11.46,3.83 RRP.2
N$11
  Top 0.152: MT_DS.4 100.38,54.13 100.38,22.5 100.84,22.05 100.84,10.69 99.09,8.94 MU1.6
N$12
  Top 0.152: Q4.2 49.55,41.63 53.29,37.9 53.29,37.59 D4.A 53.36,37.52 54.05,36.83 60.91,36.83 K2.1
N$13
  Top 0.152: R11.2 43.23,59.69 45.74,59.69 46.96,60.91 Q6.1
N$14
  Top 0.254: HCTL.P$2 64.95,5.13 64.95,16.87 60.6,21.21 60.6,27.3 70.13,36.83 73.1,36.83 K2.2
N$15
  Top 0.152: R14.2 45.74,38.12 48.26,38.12 49.48,39.34 Q4.1
N$16
  Top 0.152: 36.83,45.75 45.67,45.75 R14.1 | 36.83,45.75 R13.1 36.83,45.75 | 36.83,45.75 33.32,49.25 22.43,49.25 14.58,57.1 13.97,57.1 IC1.10
N$17  (via drill 0.35)
  Top 0.152: v17.86,55.96 17.86,57.94 25.86,65.94 39.27,65.94 R6.1 43.15,67.31 R11.1
  Bottom 0.152: v17.86,55.96 11.46,49.56 IC1.4
N$21
  Top 0.152: Q6.2 47.04,63.19 50.77,59.46 50.77,59.23 D6.A 50.85,59.16 54.13,55.88 60.91,55.88 K1.1
RRPCTL
  Top 0.152: R3.2 3.84,47.04 3.84,49.48 IC1.1 3.91,49.48 4.37,49.48 10.46,55.58 11.84,55.58 12.75,56.49 12.75,58.32 28.14,73.71 31.34,73.71 33.78,76.15 40.64,76.15 41.86,74.93 PCB2.4
RRT_DSMS
  Bottom 0.152: PCB2.9 27.91,74.93 37.9,84.91 37.9,87.81 39.95,89.86 73.48,89.86 95.73,67.61 100.31,67.61 RT_DS.3
RRT_DSO
  Bottom 0.152: RT_DS.4 100.38,65.56 100.38,61.9 101.37,60.91 101.37,16.26 99.09,13.97 MU1.4
SCK  (via drill 0.35)
  Top 0.152: MU1.13 73.71,11.46 73.71,11.84 82.4,20.52 82.4,29.9 83.77,31.27 83.77,33.02 82.55,34.24 PCB2.52 | v51.08,32.49 35.15,32.49 33.4,34.24 33.02,34.24 MU2.13
  Bottom 0.152: v51.08,32.49 51.54,32.49 53.52,34.47 82.4,34.47 82.55,34.31 PCB2.52
UVCTL
  Top 0.152: R7.2 8.87,47.04 8.87,49.48 IC1.3
  Bottom 0.152: IC1.3 8.94,49.56 8.94,50.17 15.57,56.79 15.57,58.17 16.18,58.78 16.87,58.78 33.1,75.01 33.1,75.46 33.78,76.15 45.74,76.15 46.96,74.93 PCB2.2

### Text on the board
tNames: APFC NUT_MGMT V2.2 | 5V | 12V | 240VAC